# Altium schematic sheet Mosfets.SchDoc: Mosfets
size Letter; DocumentNumber: 5; SheetNumber: 11; SheetTotal: 11
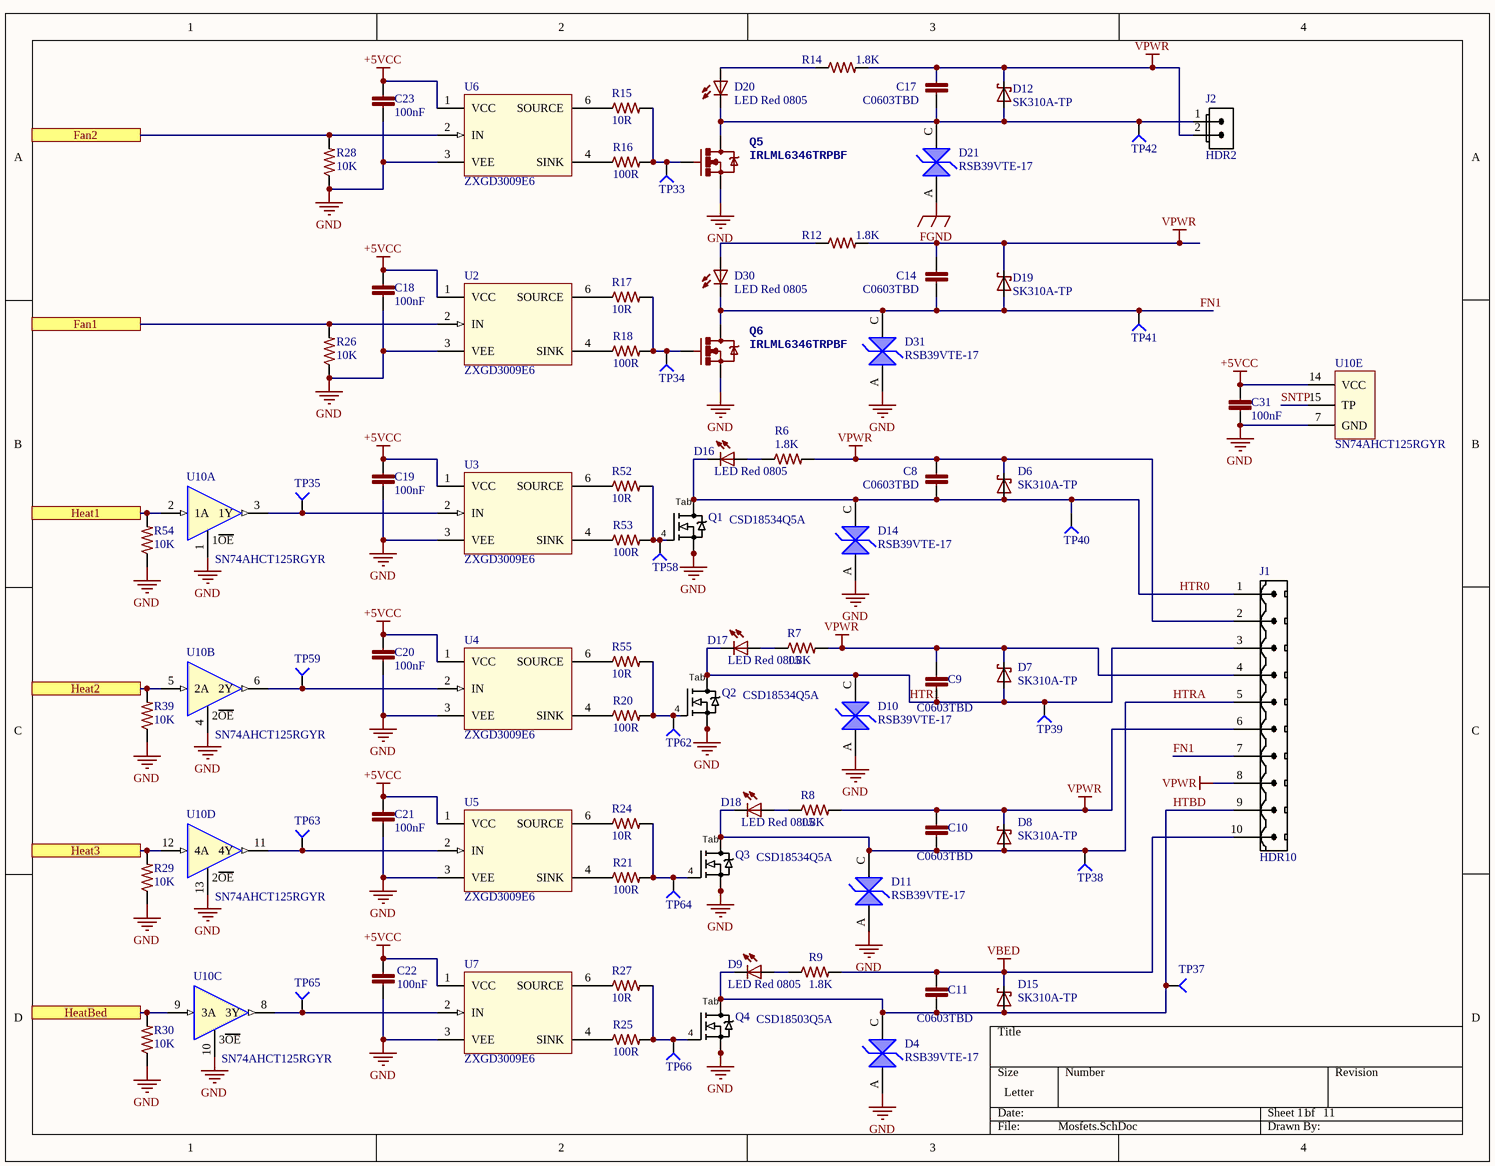
[diagram p0: Mosfets.SchDoc]

## Parts
C8  C0603TBD  [C0603]
C9  C0603TBD  [C0603]
C10  C0603TBD  [C0603]
C11  C0603TBD  [C0603]
C14  C0603TBD  [C0603]
C17  C0603TBD  [C0603]
C18  100nF  [C0402]
C19  100nF  [C0402]
C20  100nF  [C0402]
C21  100nF  [C0402]
C22  100nF  [C0402]
C23  100nF  [C0402]
C31  100nF  [C0402]
D4  RSB39VTE-17  [SOD323-R]
D6  SK310A-TP  [SMA-SM]
D7  SK310A-TP  [SMA-SM]
D8  SK310A-TP  [SMA-SM]
D9  PART: LED Red 0805  [LED2012120]  (hidden comment: Red)
D10  RSB39VTE-17  [SOD323-R]
D11  RSB39VTE-17  [SOD323-R]
D12  SK310A-TP  [SMA-SM]
D14  RSB39VTE-17  [SOD323-R]
D15  SK310A-TP  [SMA-SM]
D16  PART: LED Red 0805  [LED2012120]  (hidden comment: Red)
D17  PART: LED Red 0805  [LED2012120]  (hidden comment: Red)
D18  PART: LED Red 0805  [LED2012120]  (hidden comment: Red)
D19  SK310A-TP  [SMA-SM]
D20  PART: LED Red 0805  [LED2012120]  (hidden comment: Red)
D21  RSB39VTE-17  [SOD323-R]
D30  PART: LED Red 0805  [LED2012120]  (hidden comment: Red)
D31  RSB39VTE-17  [SOD323-R]
J1  value HDR10  [MSTBV10]  (hidden comment: Molex 0395311010)
J2  value HDR2  [70543-01 PIN-IN-PASTE]  (hidden comment: CONN 2PIN VERT 0.1" SHRD LOCKING PIP)
Q1  CSD18534Q5A  [SOT669_Universal]
Q2  CSD18534Q5A  [SOT669_Universal]
Q3  CSD18534Q5A  [SOT669_Universal]
Q4  CSD18503Q5A  [SOT669_Universal]
Q5  IRLML6346TRPBF  [SOT23-3]
Q6  IRLML6346TRPBF  [SOT23-3]
R6  1.8K  [R0603]
R7  1.8K  [R0603]
R8  1.8K  [R0603]
R9  1.8K  [R0603]
R12  1.8K  [R0603]
R14  1.8K  [R0603]
R15  10R  [R0402]
R16  100R  [R0402]
R17  10R  [R0402]
R18  100R  [R0402]
R20  100R  [R0402]
R21  100R  [R0402]
R24  10R  [R0402]
R25  100R  [R0402]
R26  10K  [R0402]
R27  10R  [R0402]
R28  10K  [R0402]
R29  10K  [R0402]
R30  10K  [R0402]
R39  10K  [R0402]
R52  10R  [R0402]
R53  100R  [R0402]
R54  10K  [R0402]
R55  10R  [R0402]
TP33  TP4  [TP-2]  (value not drawn)  (no BOM)
TP34  TP4  [TP-2]  (value not drawn)  (no BOM)
TP35  TP4  [TP-2]  (value not drawn)  (no BOM)
TP37  TP4  [TP-2]  (value not drawn)  (no BOM)
TP38  TP4  [TP-2]  (value not drawn)  (no BOM)
TP39  TP4  [TP-2]  (value not drawn)  (no BOM)
TP40  TP4  [TP-2]  (value not drawn)  (no BOM)
TP41  TP4  [TP-2]  (value not drawn)  (no BOM)
TP42  TP4  [TP-2]  (value not drawn)  (no BOM)
TP58  TP4  [TP-2]  (value not drawn)  (no BOM)
TP59  TP4  [TP-2]  (value not drawn)  (no BOM)
TP62  TP4  [TP-2]  (value not drawn)  (no BOM)
TP63  TP4  [TP-2]  (value not drawn)  (no BOM)
TP64  TP4  [TP-2]  (value not drawn)  (no BOM)
TP65  TP4  [TP-2]  (value not drawn)  (no BOM)
TP66  TP4  [TP-2]  (value not drawn)  (no BOM)
U2  ZXGD3009E6  [SOT26P285X140-6L]
U3  ZXGD3009E6  [SOT26P285X140-6L]
U4  ZXGD3009E6  [SOT26P285X140-6L]
U5  ZXGD3009E6  [SOT26P285X140-6L]
U6  ZXGD3009E6  [SOT26P285X140-6L]
U7  ZXGD3009E6  [SOT26P285X140-6L]
U10  SN74AHCT125RGYR  [QFN50P350X350X100_RGY_S-PVQFN-N14]  (parts A,B,C,D,E of 5)

## Ports
Fan1, Fan2, Heat1, Heat2, Heat3, HeatBed

## Nets
+5VCC: C18.2 C19.2 C20.2 C21.2 C22.1 C23.2 C31.2 U2.1(VCC) U3.1(VCC) U4.1(VCC) U5.1(VCC) U6.1(VCC) U7.1(VCC) U10.14(VCC)
FGND: D21.A
GND: C18.1 C19.1 C20.1 C21.1 C22.2 C23.1 C31.1 D4.A D10.A D11.A D14.A D31.A Q1.1(S) Q1.2(S) Q1.3(S) Q2.1(S) Q2.2(S) Q2.3(S) Q3.1(S) Q3.2(S) Q3.3(S) Q4.1(S) Q4.2(S) Q4.3(S) Q5.2(S) Q6.2(S) R26.1 R28.1 R29.1 R30.1 R39.1 R54.1 U2.3(VEE) U3.3(VEE) U4.3(VEE) U5.3(VEE) U6.3(VEE) U7.3(VEE) U10.1(1OE) U10.4(2OE) U10.7(GND) U10.10(3OE) U10.13(4OE)
VBED: C11.1 D15.C J1.10 R9.2
VPWR: C8.1 C9.1 C10.1 C14.1 C17.1 D6.C D7.C D8.C D12.C D19.C J1.2 J1.4 J1.6 J1.8 J2.2(S) R6.2 R7.2 R8.2 R12.2 R14.2
Fan1: R26.2 U2.2(IN) ; port Fan1
Fan2: R28.2 U6.2(IN) ; port Fan2
FN1: C14.2 D19.A D30.C D31.C J1.7 Q6.3(D) TP41.1
Heat1: R54.2 U10.2(1A) ; port Heat1
Heat2: R39.2 U10.5(2A) ; port Heat2
Heat3: R29.2 U10.12(4A) ; port Heat3
HeatBed: R30.2 U10.9(3A) ; port HeatBed
HTBD: C11.2 D4.C D9.C D15.A J1.9 Q4.TAB(D) TP37.1
HTR0: C8.2 D6.A D14.C D16.C J1.1 Q1.TAB(D) TP40.1
HTR1: C9.2 D7.A D10.C D17.C J1.3 Q2.TAB(D) TP39.1
HTRA: C10.2 D8.A D11.C D18.C J1.5 Q3.TAB(D) TP38.1
SNTP: U10.15(TP)
NetC17_2: C17.2 D12.A D20.C D21.C J2.1(S) Q5.3(D) TP42.1
NetD9_A: D9.A R9.1
NetD16_A: D16.A R6.1
NetD17_A: D17.A R7.1
NetD18_A: D18.A R8.1
NetD20_A: D20.A R14.1
NetD30_A: D30.A R12.1
NetQ1_4: Q1.4(G) R52.2 R53.2 TP58.1
NetQ2_4: Q2.4(G) R20.2 R55.2 TP62.1
NetQ3_4: Q3.4(G) R21.2 R24.2 TP64.1
NetQ4_4: Q4.4(G) R25.2 R27.2 TP66.1
NetQ5_1: Q5.1(G) R15.2 R16.2 TP33.1
NetQ6_1: Q6.1(G) R17.2 R18.2 TP34.1
NetR15_1: R15.1 U6.6(SOURCE)
NetR16_1: R16.1 U6.4(SINK)
NetR17_1: R17.1 U2.6(SOURCE)
NetR18_1: R18.1 U2.4(SINK)
NetR20_1: R20.1 U4.4(SINK)
NetR21_1: R21.1 U5.4(SINK)
NetR24_1: R24.1 U5.6(SOURCE)
NetR25_1: R25.1 U7.4(SINK)
NetR27_1: R27.1 U7.6(SOURCE)
NetR52_1: R52.1 U3.6(SOURCE)
NetR53_1: R53.1 U3.4(SINK)
NetR55_1: R55.1 U4.6(SOURCE)
NetTP35_1: TP35.1 U3.2(IN) U10.3(1Y)
NetTP59_1: TP59.1 U4.2(IN) U10.6(2Y)
NetTP63_1: TP63.1 U5.2(IN) U10.11(4Y)
NetTP65_1: TP65.1 U7.2(IN) U10.8(3Y)

## Notes on the sheet
- (in symbol CSD18503Q5A) Tab
- (in symbol CSD18534Q5A) Tab

## Library data of the parts
C8-C11 C14 C17 = C0603TBD: Capacitor Non Polarized; MANUFACTURER #: DNI-C0603TBD; VALUE: C0603TBD; DNI: DNI
C18-C23 C31 = GRM155R71C104KA88D: CAP CER 0402 100nF 16V 10% X7R; MANUFACTURER: Murata; PART: 0.1uF 16V X7R 0402; PART DESCRIPTION: 0.10µF ±10% 16V Ceramic Capacitor X7R 0402 (1005 Metric); EE_SPEC: 100nF 16V X7R 0402; VALUE: 100nF; MANUFACTURER #: GRM155R71C104KA88D; DISTRIBUTOR #: 490-3261-2-ND; DISTRIBUTOR: Digi-Key Electronics; TOLERANCE: 10%
D4 D10 D11 D14 D21 D31 = RSB39VTE-17: DIODE TVS; MANUFACTURER: Rohm; PART: TVS DIODE 30VWM SOD323; TOLERANCE: -NA-; VALUE: 30V; EE_SPEC: 30Vso 30pF; MANUFACTURER #: RSB39VTE-17; DISTRIBUTOR #: RSB39VTE-17TR-ND; DISTRIBUTOR: Digi-Key Electronics; PART DESCRIPTION: TVS DIODE 30VWM SOD323
D6-D8 D12 D15 D19 = SK310A: DIODE Schottky 3A SMA; MANUFACTURER: MCC; PART: Schottky Diode 100V 3A; PART DESCRIPTION: Diode Schottky 100V 3A Surface Mount DO-214AC (HSMA); TOLERANCE: -NA-; VALUE: -NA-; EE_SPEC: 100V 3A; MANUFACTURER #: SK310A; DISTRIBUTOR #: SK310A-TPTR-ND; DISTRIBUTOR: Digi-Key Electronics
D9 D16-D18 D20 D30 = 5988110107F: LED 0805 Red; MANUFACTURER: Dialight; PART DESCRIPTION: Red 635nm LED Indication - Discrete 2.2V 0805 (2012 Metric); TOLERANCE: -NA-; EE_SPEC: Vf=2.2V; VALUE: Red; MANUFACTURER #: 5988110107F; DISTRIBUTOR #: 350-2038-2-ND; DISTRIBUTOR: Digi-Key Electronics
J1 = CONN 10POS 0.2" VERT SHRD: MSBTV10 10 port connector same as RAMBo; PART: CONN TERM BLOCK HDR 10POS VERT 5.08MM; PART DESCRIPTION: 10 Position Terminal Block Header, Male Pins, Shrouded (4 Side) 0.200" (5.08mm) Vertical Through Hole; TOLERANCE: -NA-; MANUFACTURER #: 0395311010; MANUFACTURER: Molex; DISTRIBUTOR #: WM7843-ND; DISTRIBUTOR: Digi-Key Electronics; EE_SPEC: -NA-
J2 = CONN 2PIN VERT 0.1" SHRD LOCKING PIP: Connector 2pos - Pin in Paste; MANUFACTURER: Molex; MANUFACTURER #: 0705430001; PART: 2 Pin Conn; PART DESCRIPTION: 2 Positions Header, Shrouded Connector 0.100" (2.54mm) Through Hole Gold; TOLERANCE: -NA-; DISTRIBUTOR #: WM4800-ND; DISTRIBUTOR: Digikey; EE_SPEC: -NA-
Q1-Q3 = CSD18534Q5A: MOSFET N-CH 40V 100A 8VSON; MANUFACTURER: TI; PART DESCRIPTION: MOSFET N-CH 60V 13A 8VSON; VALUE: N-FET; MANUFACTURER #: CSD18534Q5A; PART: CSD18534Q5A
Q4 = CSD18503Q5A: MOSFET N-CH 40V 100A 8VSON; MANUFACTURER: TI; VALUE: N-FET; MANUFACTURER #: CSD18503Q5A; PART DESCRIPTION: MOSFET N-CH 40V 100A 8VSON; EE_SPEC: 40V 100A
Q5 Q6 = IRLML6346TRPBF: Mosfet N-Channel 30V 3.4A 63mOhm; MANUFACTURER: Infineon; PART: MOSFET N-Chan 30V 3.4A; PART DESCRIPTION: N-Channel 30V 3.4A (Ta) 1.3W (Ta) Surface Mount Micro3™/SOT-23; TOLERANCE: -NA-; VALUE: N-FET; MANUFACTURER #: IRLML6346TRPBF; DISTRIBUTOR #: IRLML6346TRPBFTR-ND; DISTRIBUTOR: Digi-Key Electronics; EE_SPEC: 30V 3.4A 63mOhm
R6-R9 R12 R14 = RC0603JR-071K8L: RES 0603 1.8K 100mW 5%; MANUFACTURER: Yageo; PART: 1.8k 5% 0603; PART DESCRIPTION: 1.8k Ohm ±5% 0.1W, 1/10W Chip Resistor 0603 (1608 Metric) Moisture Resistant Thick Film; EE_SPEC: 1/10W; VALUE: 1.8K; MANUFACTURER #: RC0603JR-071K8L; DISTRIBUTOR #: 311-1.8KGRTR-ND; DISTRIBUTOR: Digi-Key Electronics; TOLERANCE: 5%
R15 R17 R24 R27 R52 R55 = RC0402FR-0710RL: RES SMD 10 OHM 1% 1/16W 0402; MANUFACTURER: Yageo; PART DESCRIPTION: 10 Ohm ±1% 0.063W, 1/16W Chip Resistor 0402 (1005 Metric) Moisture Resistant Thick Film; EE_SPEC: 10R 1% 0402; VALUE: 10R; MANUFACTURER #: RC0402FR-0710RL; DISTRIBUTOR #: 311-10.0LRTR-ND; DISTRIBUTOR: Digi-Key Electronics; PART: 10R; TOLERANCE: 1%
R16 R18 R20 R21 R25 R53 = RES 100R 0402 1%: RES SMD 100 OHM 1% 1/16W 0402; MANUFACTURER: Yageo; MANUFACTURER #: RC0402FR-07100RL; PART: 100R 1% 0402; PART DESCRIPTION: 100 Ohm ±1% 0.063W, 1/16W Chip Resistor 0402 (1005 Metric) Moisture Resistant Thick Film; VALUE: 100R; DISTRIBUTOR #: 311-100LRTR-ND; DISTRIBUTOR: Digi-Key Electronics; TOLERANCE: 1%; EE_SPEC: 1/16W
R26 R28-R30 R39 R54 = RC0402FR-0710KP: RES SMD 10K OHM 1% 1/16W 0402; MANUFACTURER: Yageo; PART: 10k 1% 0402; PART DESCRIPTION: 10k Ohm ±1% 0.063W, 1/16W Chip Resistor 0402 (1005 Metric) Moisture Resistant Thick Film; VALUE: 10K; MANUFACTURER #: RC0402FR-0710KP; DISTRIBUTOR #: YAG1249TR-ND; DISTRIBUTOR: Digi-Key Electronics; TOLERANCE: 1%; EE_SPEC: 1/16W
TP33-TP35 TP37-TP42 TP58 TP59 TP62-TP66 = Socket: MANUFACTURER #: NOTAPART-Testpoint
U2-U7 = ZXGD3009E6: MOSFET DRVR 3A 1-OUT High Speed Non-Inv6-Pin SOT-26 T/R; MANUFACTURER #: ZXGD3009E6TA; MANUFACTURER: Diodes Incorporated; PART: IC GATE DRVR IGBT/MOSFET SOT23-6; PART DESCRIPTION: Low-Side Gate Driver IC Non-Inverting SOT-26; TOLERANCE: -NA-; EE_SPEC: 40V 2A; DISTRIBUTOR #: ZXGD3009E6TADITR-ND; DISTRIBUTOR: Digi-Key Electronics; VALUE: ZXGD3009E6
U10 = SN74AHCT125: Quadruple Bus Buffer Gates With 3-State Outputs 14-VQFN -40 to 125; MANUFACTURER: Texas Instruments; PART: IC BUS BUFFER TRI-ST QD 14VQFN; PART DESCRIPTION: Buffer, Non-Inverting 4 Element 1 Bit per Element Push-Pull Output 14-VQFN (3.5x3.5); TOLERANCE: -NA-; VALUE: Tri-State Buffer; EE_SPEC: 5V 8mA; MANUFACTURER #: SN74AHCT125RGYR; DISTRIBUTOR #: 296-13910-2-ND; DISTRIBUTOR: Digi-Key Electronics